# Altium schematic sheet 05_Codec&PA.SchDoc
size A3
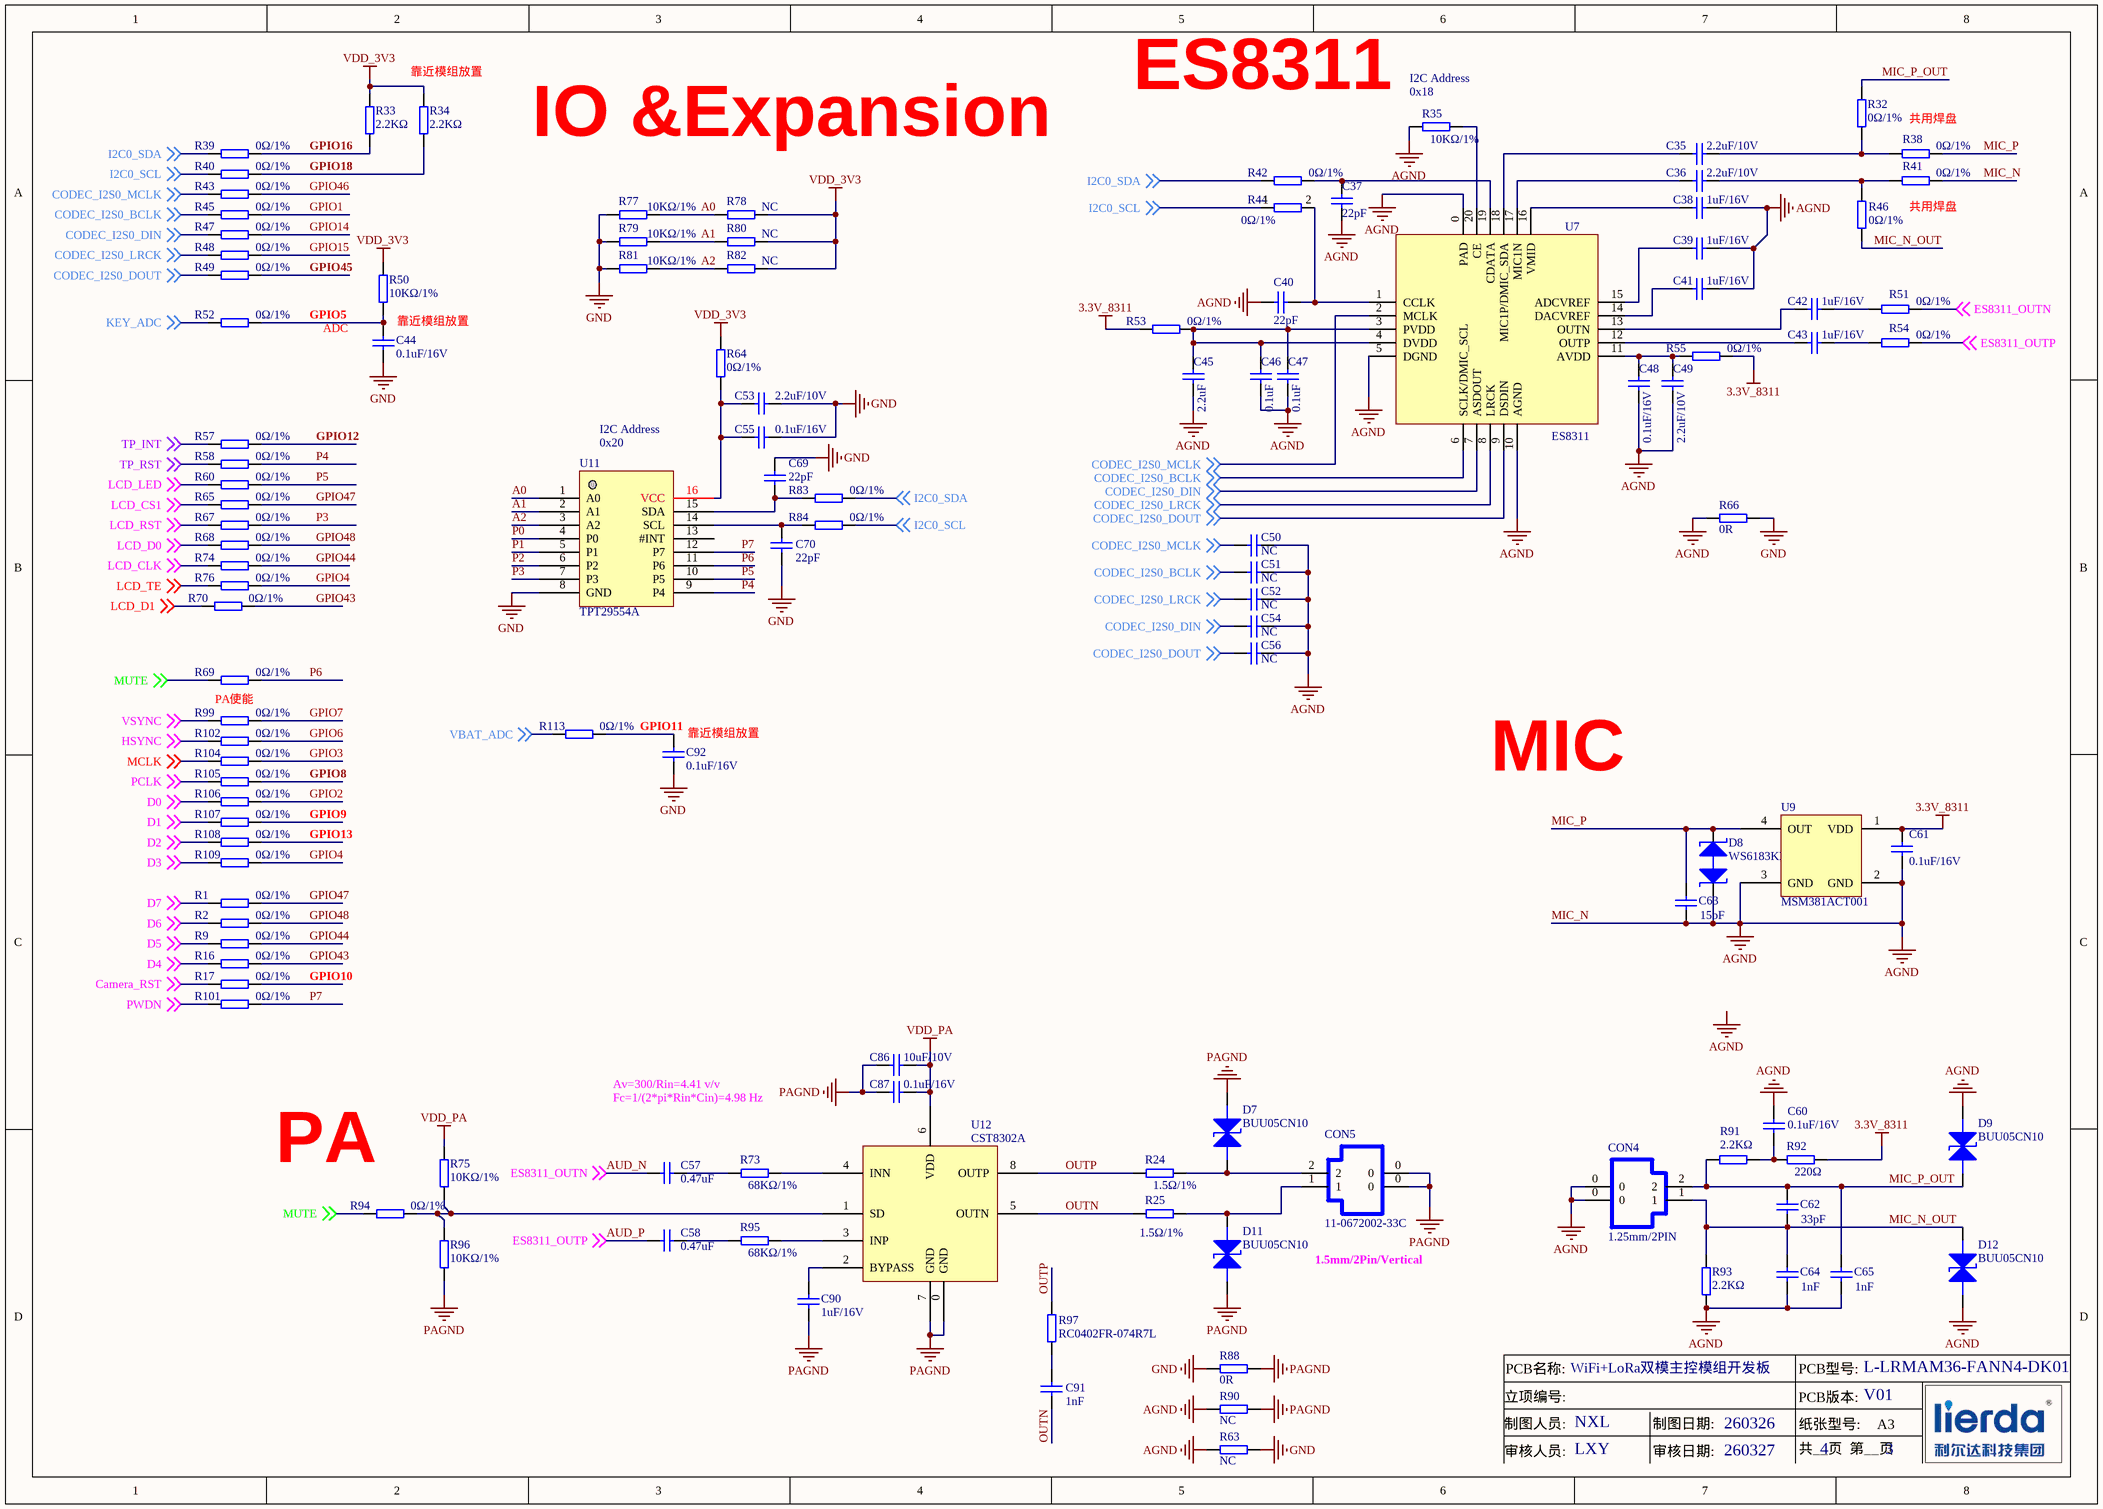
[diagram p0: 05_Codec&PA.SchDoc]

## Parts
C35  2.2uF/10V  [0402C_0.4D]
C36  2.2uF/10V  [0402C_0.4D]
C37  22pF  [0402C_0.4D]
C38  1uF/16V  [0402C_0.4D]
C39  1uF/16V  [0402C_0.4D]
C40  22pF  [0402C_0.4D]
C41  1uF/16V  [0402C_0.4D]
C42  1uF/16V  [0402C_0.4D]
C43  1uF/16V  [0402C_0.4D]
C44  0.1uF/16V  [0402C_0.4D]
C45  2.2uF  [0402C_0.4D]
C46  0.1uF  [0402C_0.4D]
C47  0.1uF  [0402C_0.4D]
C48  0.1uF/16V  [0402C_0.4D]
C49  2.2uF/10V  [0402C_0.4D]
C50  NC  [0402C_0.4D]
C51  NC  [0402C_0.4D]
C52  NC  [0402C_0.4D]
C53  2.2uF/10V  [0402C_0.4D]
C54  NC  [0402C_0.4D]
C55  0.1uF/16V  [0402C_0.4D]
C56  NC  [0402C_0.4D]
C57  0.47uF  [0402C_0.4D]
C58  0.47uF  [0402C_0.4D]
C60  0.1uF/16V  [0402C_0.4D]
C61  0.1uF/16V  [0402C_0.4D]
C62  33pF  [0402C_0.4D]
C63  15pF  [0402C_0.4D]
C64  1nF  [0402C_0.4D]
C65  1nF  [0402C_0.4D]
C69  22pF  [0402C_0.4D]
C70  22pF  [0402C_0.4D]
C86  10uF/10V  [0402C_0.4D]
C87  0.1uF/16V  [0402C_0.4D]
C90  1uF/16V  [0402C_0.4D]
C91  1nF  [0402C_0.4D]
C92  0.1uF/16V  [0402C_0.4D]
CON4  FPC-2  [SMD-1.25-2P]  (value not drawn)
CON5  11-0672002-33C  [SMD-1.25-2P]
D7  产品型号: BUU05CN10  [DFN1006-NP]  (hidden comment: DIODE-2TVS)
D8  WS6183KF  [DFN1006-NP]
D9  产品型号: BUU05CN10  [DFN1006-NP]  (hidden comment: DIODE-2TVS)
D11  产品型号: BUU05CN10  [DFN1006-NP]  (hidden comment: DIODE-2TVS)
D12  产品型号: BUU05CN10  [DFN1006-NP]  (hidden comment: DIODE-2TVS)
R1  0Ω/1%  [0402R_0.4D]
R2  0Ω/1%  [0402R_0.4D]
R9  0Ω/1%  [0402R_0.4D]
R16  0Ω/1%  [0402R_0.4D]
R17  0Ω/1%  [0402R_0.4D]
R24  1.5Ω/1%  [0402R_0.4D]
R25  1.5Ω/1%  [0402R_0.4D]
R32  0Ω/1%  [0402R_0.4D]
R33  2.2KΩ  [0402R_0.4D]
R34  2.2KΩ  [0402R_0.4D]
R35  10KΩ/1%  [0402R_0.4D]
R38  0Ω/1%  [0402R_0.4D]
R39  0Ω/1%  [0402R_0.4D]
R40  0Ω/1%  [0402R_0.4D]
R41  0Ω/1%  [0402R_0.4D]
R42  0Ω/1%  [0402R_0.4D]
R43  0Ω/1%  [0402R_0.4D]
R44  0Ω/1%  [0402R_0.4D]
R45  0Ω/1%  [0402R_0.4D]
R46  0Ω/1%  [0402R_0.4D]
R47  0Ω/1%  [0402R_0.4D]
R48  0Ω/1%  [0402R_0.4D]
R49  0Ω/1%  [0402R_0.4D]
R50  10KΩ/1%  [0402R_0.4D]
R51  0Ω/1%  [0402R_0.4D]
R52  0Ω/1%  [0402R_0.4D]
R53  0Ω/1%  [0402R_0.4D]
R54  0Ω/1%  [0402R_0.4D]
R55  0Ω/1%  [0402R_0.4D]
R57  0Ω/1%  [0402R_0.4D]
R58  0Ω/1%  [0402R_0.4D]
R60  0Ω/1%  [0402R_0.4D]
R63  产品型号: NC  [0805R_0.6D]  (hidden comment: RES)
R64  0Ω/1%  [0402R_0.4D]
R65  0Ω/1%  [0402R_0.4D]
R66  产品型号: 0R  [0805R_0.6D]  (hidden comment: RES)
R67  0Ω/1%  [0402R_0.4D]
R68  0Ω/1%  [0402R_0.4D]
R69  0Ω/1%  [0402R_0.4D]
R70  0Ω/1%  [0402R_0.4D]
R73  68KΩ/1%  [0402R_0.4D]
R74  0Ω/1%  [0402R_0.4D]
R75  10KΩ/1%  [0402R_0.4D]
R76  0Ω/1%  [0402R_0.4D]
R77  10KΩ/1%  [0402R_0.4D]
R78  NC  [0402R_0.4D]
R79  10KΩ/1%  [0402R_0.4D]
R80  NC  [0402R_0.4D]
R81  10KΩ/1%  [0402R_0.4D]
R82  NC  [0402R_0.4D]
R83  0Ω/1%  [0402R_0.4D]
R84  0Ω/1%  [0402R_0.4D]
R88  产品型号: 0R  [0805R_0.6D]  (hidden comment: RES)
R90  产品型号: NC  [0805R_0.6D]  (hidden comment: RES)
R91  2.2KΩ  [0402R_0.4D]
R92  220Ω  [0402R_0.4D]
R93  2.2KΩ  [0402R_0.4D]
R94  0Ω/1%  [0402R_0.4D]
R95  68KΩ/1%  [0402R_0.4D]
R96  10KΩ/1%  [0402R_0.4D]
R97  产品型号: RC0402FR-074R7L  [0402R_0.4D]  (hidden comment: RES)
R99  0Ω/1%  [0402R_0.4D]
R101  0Ω/1%  [0402R_0.4D]
R102  0Ω/1%  [0402R_0.4D]
R104  0Ω/1%  [0402R_0.4D]
R105  0Ω/1%  [0402R_0.4D]
R106  0Ω/1%  [0402R_0.4D]
R107  0Ω/1%  [0402R_0.4D]
R108  0Ω/1%  [0402R_0.4D]
R109  0Ω/1%  [0402R_0.4D]
R113  0Ω/1%  [0402R_0.4D]
U7  ES8311  [QFN20(0.4)-3X3]
U9  MSM381ACT001  [麦克风MSM381ACT001]
U11  TPT29554A  [TSSOP-16(0.65)-5X6.6]
U12  CST8302A  [SOP-8(1.27)-GND]

## Nets
3.3V_8311: C61.2 R53.1 R55.2 R92.2 U9.1(VDD)
GND: C44.2 C53.1 C55.1 C69.2 C70.1 C92.2 R63.2 R66.1 R77.1 R79.1 R81.1 R88.2 U11.8(GND)
MIC_N: C37.1 C38.1 C39.1 C40.1 C41.1 C45.1 C46.1 C47.1 C48.1 C49.1 C50.1 C51.1 C52.1 C54.1 C56.1 C60.2 C61.1 C63.1 C64.1 C65.1 CON4.0 D8.A D9.K D12.A R35.1 R41.2 R63.1 R66.2 R90.1 R93.1 U7.0(PAD) U7.5(DGND) U7.10(AGND) U9.2(GND) U9.3(GND)  [also labelled AGND]
PAGND: C86.2 C87.2 C90.2 CON5.0 D7.K D11.A R88.1 R90.2 R96.1 U12.0(GND) U12.7(GND)
VDD_3V3: R33.2 R34.2 R50.2 R64.2 R78.2 R80.2 R82.2
VDD_PA: C86.1 C87.1 R75.2 U12.6(VDD)
A0: R77.2 R78.1 U11.1(A0)
A1: R79.2 R80.1 U11.2(A1)
A2: R81.2 R82.1 U11.3(A2)
AUD_N: C57.1 R51.2 ; off-sheet ES8311_OUTN  [also labelled ES8311_OUTN]
AUD_P: C58.1 R54.2 ; off-sheet ES8311_OUTP  [also labelled ES8311_OUTP]
Camera_RST: R17.1 ; off-sheet Camera_RST
CODEC_I2S0_BCLK: C51.2 R45.1 U7.6(SCLK/DMIC_SCL) ; off-sheet CODEC_I2S0_BCLK
CODEC_I2S0_DIN: C54.2 R47.1 U7.7(ASDOUT) ; off-sheet CODEC_I2S0_DIN
CODEC_I2S0_DOUT: C56.2 R49.1 U7.9(DSDIN) ; off-sheet CODEC_I2S0_DOUT
CODEC_I2S0_LRCK: C52.2 R48.1 U7.8(LRCK) ; off-sheet CODEC_I2S0_LRCK
CODEC_I2S0_MCLK: C50.2 R43.1 U7.2(MCLK) ; off-sheet CODEC_I2S0_MCLK
D0: R106.1 ; off-sheet D0
D1: R107.1 ; off-sheet D1
D2: R108.1 ; off-sheet D2
D3: R109.1 ; off-sheet D3
D4: R16.1 ; off-sheet D4
D5: R9.1 ; off-sheet D5
D6: R2.1 ; off-sheet D6
D7: R1.1 ; off-sheet D7
GPIO1: R45.2
GPIO2: R106.2
GPIO3: R104.2
GPIO4: R76.2 R109.2
GPIO5: C44.1 R50.1 R52.2
GPIO6: R102.2
GPIO7: R99.2
GPIO8: R105.2
GPIO9: R107.2
GPIO10: R17.2
GPIO11: C92.1 R113.2
GPIO12: R57.2
GPIO13: R108.2
GPIO14: R47.2
GPIO15: R48.2
GPIO16: R33.1 R39.2
GPIO18: R34.1 R40.2
GPIO43: R16.2 R70.2
GPIO44: R9.2 R74.2
GPIO45: R49.2
GPIO46: R43.2
GPIO47: R1.2 R65.2
GPIO48: R2.2 R68.2
HSYNC: R102.1 ; off-sheet HSYNC
I2C0_SCL: R40.1 R44.1 R84.2 ; off-sheet I2C0_SCL
I2C0_SDA: R39.1 R42.1 R83.2 ; off-sheet I2C0_SDA
KEY_ADC: R52.1 ; off-sheet KEY_ADC
LCD_CLK: R74.1 ; off-sheet LCD_CLK
LCD_CS1: R65.1 ; off-sheet LCD_CS1
LCD_D0: R68.1 ; off-sheet LCD_D0
LCD_D1: R70.1 ; off-sheet LCD_D1
LCD_LED: R60.1 ; off-sheet LCD_LED
LCD_RST: R67.1 ; off-sheet LCD_RST
LCD_TE: R76.1 ; off-sheet LCD_TE
MCLK: R104.1 ; off-sheet MCLK
MIC_N_OUT: C62.1 C64.2 CON4.1 D12.K R46.1 R93.2
MIC_P: C63.2 D8.K R38.2 U9.4(OUT)
MIC_P_OUT: C62.2 C65.2 CON4.2 D9.A R32.2 R91.1
MUTE: R69.1 R94.1 ; off-sheet MUTE
OUTN: C91.1 R25.1 U12.5(OUTN)
OUTP: R24.1 R97.2 U12.8(OUTP)
P0: U11.4(P0)
P1: U11.5(P1)
P2: U11.6(P2)
P3: R67.2 U11.7(P3)
P4: R58.2 U11.9(P4)
P5: R60.2 U11.10(P5)
P6: R69.2 U11.11(P6)
P7: R101.2 U11.12(P7)
PCLK: R105.1 ; off-sheet PCLK
PWDN: R101.1 ; off-sheet PWDN
TP_INT: R57.1 ; off-sheet TP_INT
TP_RST: R58.1 ; off-sheet TP_RST
VBAT_ADC: R113.1 ; off-sheet VBAT_ADC
VSYNC: R99.1 ; off-sheet VSYNC
NetC35_1: C35.1 U7.18(MIC1P/DMIC_SDA)
NetC35_2: C35.2 R32.1 R38.1
NetC36_1: C36.1 U7.17(MIC1N)
NetC36_2: C36.2 R41.1 R46.2
NetC37_2: C37.2 R42.2 U7.19(CDATA)
NetC38_2: C38.2 U7.16(VMID)
NetC39_2: C39.2 U7.15(ADCVREF)
NetC40_2: C40.2 R44.2 U7.1(CCLK)
NetC41_2: C41.2 U7.14(DACVREF)
NetC42_1: C42.1 R51.1
NetC42_2: C42.2 U7.13(OUTN)
NetC43_1: C43.1 R54.1
NetC43_2: C43.2 U7.12(OUTP)
NetC45_2: C45.2 C46.2 C47.2 R53.2 U7.3(PVDD) U7.4(DVDD)
NetC48_2: C48.2 C49.2 R55.1 U7.11(AVDD)
NetC53_2: C53.2 C55.2 R64.1 U11.16(VCC)
NetC57_2: C57.2 R73.1
NetC58_2: C58.2 R95.1
NetC60_1: C60.1 R91.2 R92.1
NetC69_1: C69.1 R83.1 U11.15(SDA)
NetC70_2: C70.2 R84.1 U11.14(SCL)
NetC90_1: C90.1 U12.2(BYPASS)
NetC91_2: C91.2 R97.1
NetCON5_1: CON5.1 D11.K R25.2
NetCON5_2: CON5.2 D7.A R24.2
NetR35_2: R35.2 U7.20(CE)
NetR73_2: R73.2 U12.4(INN)
NetR75_1: R75.1 R94.2 R96.2 U12.1(SD)
NetR95_2: R95.2 U12.3(INP)

Not connected (* = marked no-connect by the designer): U11 13(#INT)

## Notes on the sheet
- (near R34) 靠近模组放置
- ES8311
- (near R35) I2C Address
- (near R35) 0x18
- IO &Expansion
- (near R38) 共用焊盘
- (near R41) 共用焊盘
- ADC
- 靠近模组放置
- I2C Address
- (near U11) 0x20
- PA使能
- (near C92) 靠近模组放置
- MIC
- Fc=1/(2*pi*Rin*Cin)=4.98 Hz
- Av=300/Rin=4.41 v/v
- (near R94) PA
- 1.5mm/2Pin/Vertical
- PCB名称:
- WiFi+LoRa双模主控模组开发板
- PCB型号:
- L-LRMAM36-FANN4-DK01
- 制图人员:
- 审核人员:
- 立项编号:
- NXL
- LXY
- 制图日期:
- 审核日期:
- 260326
- 260327
- 纸张型号:
- 共__页  第__页
- PCB版本:
- 4
- V01
- A3
- 3
- Labels drawn without touching a wire or pin: AGND

## Library data of the parts
C35 C36 C45 C49 C53 = 1405001497: 2.2uF/6.3V/20%/X5R; 产品型号: CL05A225MQ5NNNC; 品名: 陶瓷电容; 原厂品牌: SAMSUNG电容; 封装: 0402; 物料状态: 优选; 存货编码: 1405001497
C37 C40 C50-C52 C54 C56 C69 C70 = 1405001320: 22pF/50V/5%/C0G; 产品型号: V220J0402C0G500NBT; 品名: 陶瓷电容; 原厂品牌: 微容VIIYONG; 封装: 0402; 物料状态: 优选; 存货编码: 1405001320
C38 C39 C41-C43 C90 = 1405004038: 1uF/16V/10%/X5R; 产品型号: CL05A105KO5NNNC; 品名: 陶瓷电容; 原厂品牌: SAMSUNG电容; 封装: 0402; 存货编码: 1405004038
C44 C46-C48 C55 C60 C61 C87 C92 = 1405001287: 0.1uF/16V/10%/X7R; 产品型号: V104K0402X7R160NBT; 品名: 陶瓷电容; 原厂品牌: 微容VIIYONG; 封装: 0402; 物料状态: 优选; 存货编码: 1405001287
C57 C58 = 1405001368: 0.47uF/10V/10%/X5R; 产品型号: V474K0402X5R100NNT; 品名: 陶瓷电容; 原厂品牌: 微容VIIYONG; 封装: 0402; 物料状态: 优选; 存货编码: 1405001368
C62 = 1405001380: 33pF/50V/5%/C0G; 产品型号: V330J0402C0G500NBT; 品名: 陶瓷电容; 原厂品牌: 微容VIIYONG; 封装: 0402; 物料状态: 优选; 存货编码: 1405001380
C63 = 1405001303: 15pF/50V/5%/C0G; 产品型号: V150J0402C0G500NBT; 品名: 陶瓷电容; 原厂品牌: 微容VIIYONG; 封装: 0402; 物料状态: 优选; 存货编码: 1405001303
C64 C65 C91 = 1405001283: 1nF/50V/5%/C0G; 产品型号: V102J0402C0G500NBT; 品名: 陶瓷电容; 原厂品牌: 微容VIIYONG; 封装: 0402; 物料状态: 优选; 存货编码: 1405001283
C86 = 1405001308: 10uF/10V/20%/X5R; 产品型号: CL05A106MP5NUNC; 品名: 陶瓷电容; 原厂品牌: SAMSUNG电容; 封装: 0402; 物料状态: 优选; 存货编码: 1405001308
CON4 = 1416001814: 1.25mm/2PIN; 品名: 线对板连接器; 原厂品牌: 肯耐特; 封装: SMD; 物料状态: 优选; 产品型号: 1.25mm/2PIN; 存货编码: 1416001814
CON5 = 1416003013: 1.25mm/2PIN; 产品型号: CNT-W125-1*2-TSM; 品名: 线对板连接器; 原厂品牌: 肯耐特; 封装: SMD; 物料状态: 优选; 存货编码: 1416003013
D7 D9 D11 D12 = 1409004678: 1通道/5V/6.5V/40W/0.32pF; 品名: ESD保护器件; 原厂品牌: BF TECH; 封装: DFN1006-2L; 物料状态: 优选; 存货编码: 1409004678
D8 = 1409004149: 1通道; 产品型号: WS05DPF-BH; 品名: ESD保护器件; 原厂品牌: WAYON（维安）; 封装: DFN1006-2L; 物料状态: 优选; 存货编码: 1409004149
R1 R2 R9 R16 R17 R32 R38-R49 R51-R55 R57 R58 R60 R64 R65 R67-R70 R74 R76 R83 R84 R94 R99 R101 R102 R104-R109 R113 = 1408000124: 产品型号: 0402WGF0000TCE; 品名: 厚膜贴片电阻; 原厂品牌: Uniohm; 封装: 0402; 物料状态: 优选; 存货编码: 1408000124
R24 R25 = 1408001205: 68KΩ/1%; 产品型号: RC0402FR-0768KL; 品名: 厚膜贴片电阻; 原厂品牌: YAGEO; 封装: 0402; 物料状态: 优选; 存货编码: 1408001205
R33 R34 R91 R93 = 1408000457: 2.2KΩ/5%; 产品型号: 0402WGJ0222TCE; 品名: 厚膜贴片电阻; 原厂品牌: Uniohm; 封装: 0402; 物料状态: 优选; 存货编码: 1408000457
R35 R50 R75 R77 R79 R81 R96 = 1408000127: 产品型号: 0402WGF1002TCE; 品名: 厚膜贴片电阻; 原厂品牌: Uniohm; 封装: 0402; 物料状态: 优选; 存货编码: 1408000127
R63 R66 R88 R90 = 1408000487: 0Ω/1%; 品名: 厚膜贴片电阻; 原厂品牌: Uniohm; 封装: 0805; 物料状态: 优选; 存货编码: 1408000487
R73 R95 = 1408001205: 产品型号: RC0402FR-0768KL; 品名: 厚膜贴片电阻; 原厂品牌: YAGEO; 封装: 0402; 物料状态: 优选; 存货编码: 1408001205
R78 R80 R82 = 1408000127: 10KΩ/1%; 产品型号: 0402WGF1002TCE; 品名: 厚膜贴片电阻; 原厂品牌: Uniohm; 封装: 0402; 物料状态: 优选; 存货编码: 1408000127
R92 = 1408006269: 220Ω/5%; 产品型号: 0402WGJ0221TCE; 品名: 厚膜贴片电阻; 原厂品牌: Uniohm; 封装: 0402; 物料状态: 优选; 存货编码: 1408006269
R97 = 1408001377: 4.7Ω/1%; 品名: 厚膜贴片电阻; 原厂品牌: YAGEO; 封装: 0402; 物料状态: 优选; 存货编码: 1408001377
U7 = ES8311: QFN20-3*3mm
U9 = SI-MIC: 1406000322
U11 = TCA9554PWR: IO扩展芯片